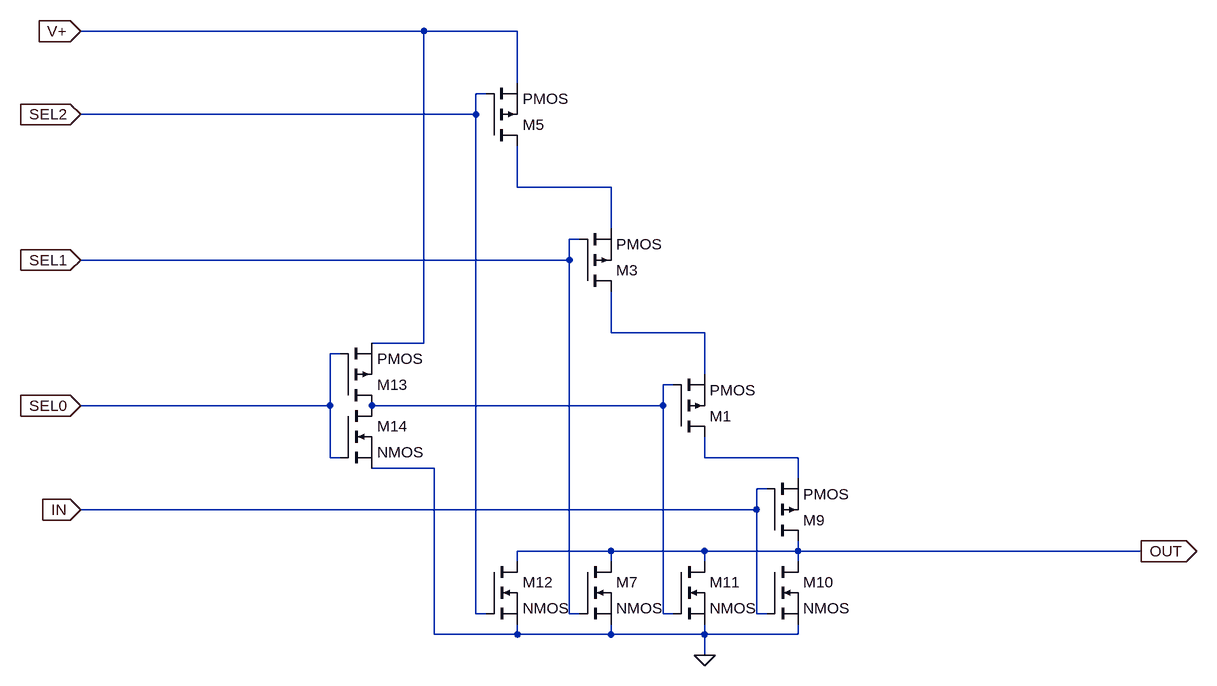
[diagram p0: schematic 4-NAND-001.asc]
4-NAND-001.asc, the LTspice schematic file:
Version 4
SHEET 1 1660 728
WIRE 464 -608 -64 -608
WIRE 608 -608 464 -608
WIRE 608 -528 608 -608
WIRE 560 -512 544 -512
WIRE 544 -480 544 -512
WIRE 544 -480 -64 -480
WIRE 608 -368 608 -432
WIRE 752 -368 608 -368
WIRE 752 -304 752 -368
WIRE 704 -288 688 -288
WIRE 688 -256 688 -288
WIRE 688 -256 -64 -256
WIRE 752 -144 752 -208
WIRE 896 -144 752 -144
WIRE 464 -128 464 -608
WIRE 464 -128 384 -128
WIRE 336 -112 320 -112
WIRE 896 -80 896 -144
WIRE 848 -64 832 -64
WIRE 320 -32 320 -112
WIRE 320 -32 -64 -32
WIRE 832 -32 832 -64
WIRE 832 -32 384 -32
WIRE 320 48 320 -32
WIRE 336 48 320 48
WIRE 896 48 896 16
WIRE 1040 48 896 48
WIRE 480 64 384 64
WIRE 1040 80 1040 48
WIRE 992 96 976 96
WIRE 976 128 976 96
WIRE 976 128 -64 128
WIRE 752 192 608 192
WIRE 896 192 752 192
WIRE 1040 192 1040 176
WIRE 1040 192 896 192
WIRE 1568 192 1040 192
WIRE 608 208 608 192
WIRE 752 208 752 192
WIRE 896 208 896 192
WIRE 1040 208 1040 192
WIRE 544 288 544 -480
WIRE 560 288 544 288
WIRE 688 288 688 -256
WIRE 704 288 688 288
WIRE 832 288 832 -32
WIRE 848 288 832 288
WIRE 976 288 976 128
WIRE 992 288 976 288
WIRE 480 320 480 64
WIRE 608 320 608 304
WIRE 608 320 480 320
WIRE 752 320 752 304
WIRE 752 320 608 320
WIRE 896 320 896 304
WIRE 896 320 752 320
WIRE 1040 320 1040 304
WIRE 1040 320 896 320
WIRE 896 352 896 320
FLAG 896 352 0
FLAG 1568 192 OUT
IOPIN 1568 192 Out
FLAG -64 -608 V+
IOPIN -64 -608 In
FLAG -64 -480 SEL2
IOPIN -64 -480 In
FLAG -64 -256 SEL1
IOPIN -64 -256 In
FLAG -64 -32 SEL0
IOPIN -64 -32 In
FLAG -64 128 IN
IOPIN -64 128 In
SYMBOL pmos 992 176 M180
SYMATTR InstName M9
SYMBOL pmos 848 16 M180
SYMATTR InstName M1
SYMBOL pmos 704 -208 M180
SYMATTR InstName M3
SYMBOL pmos 560 -432 M180
SYMATTR InstName M5
SYMBOL nmos 704 208 R0
SYMATTR InstName M7
SYMBOL nmos 992 208 R0
SYMATTR InstName M10
SYMBOL nmos 848 208 R0
SYMATTR InstName M11
SYMBOL nmos 560 208 R0
SYMATTR InstName M12
SYMBOL pmos 336 -32 M180
SYMATTR InstName M13
SYMBOL nmos 336 -32 R0
SYMATTR InstName M14

The netlist it stands for:
* 4-NAND-001.asc
M9 OUT IN N004 N004 PMOS
M1 N004 N003 N002 N002 PMOS
M3 N002 SEL1 N001 N001 PMOS
M5 N001 SEL2 V+ V+ PMOS
M7 OUT SEL1 0 0 NMOS
M10 OUT IN 0 0 NMOS
M11 OUT N003 0 0 NMOS
M12 OUT SEL2 0 0 NMOS
M13 N003 SEL0 V+ V+ PMOS
M14 N003 SEL0 0 0 NMOS
.model NMOS NMOS
.model PMOS PMOS
.lib standard.mos
.backanno
.end